# Altium schematic sheet DDS_refClk.SchDoc
size 594 x 420 mm; Address1: Address1; Address2: Address2; Address3: Address3; Address4: Address4; SheetNumber: 1; Scale: 1:1; Разраб.: Иванов; Обозначение документа: АБВГ.123456.001 Э3; Пров.: Петров; Утв.: Сидоров; Наименование организации: ОАО "Концерн "МПО-Гидроприбор"; Перв. применение: АБВГ.123456.000; Наименование изделия 1: Плата; Наименование изделия 2: Схема электрическая; Наименование изделия 3: принципиальная; Нач. отд.: Нач. отд.; Фамилия нач. отд.: Сидоров
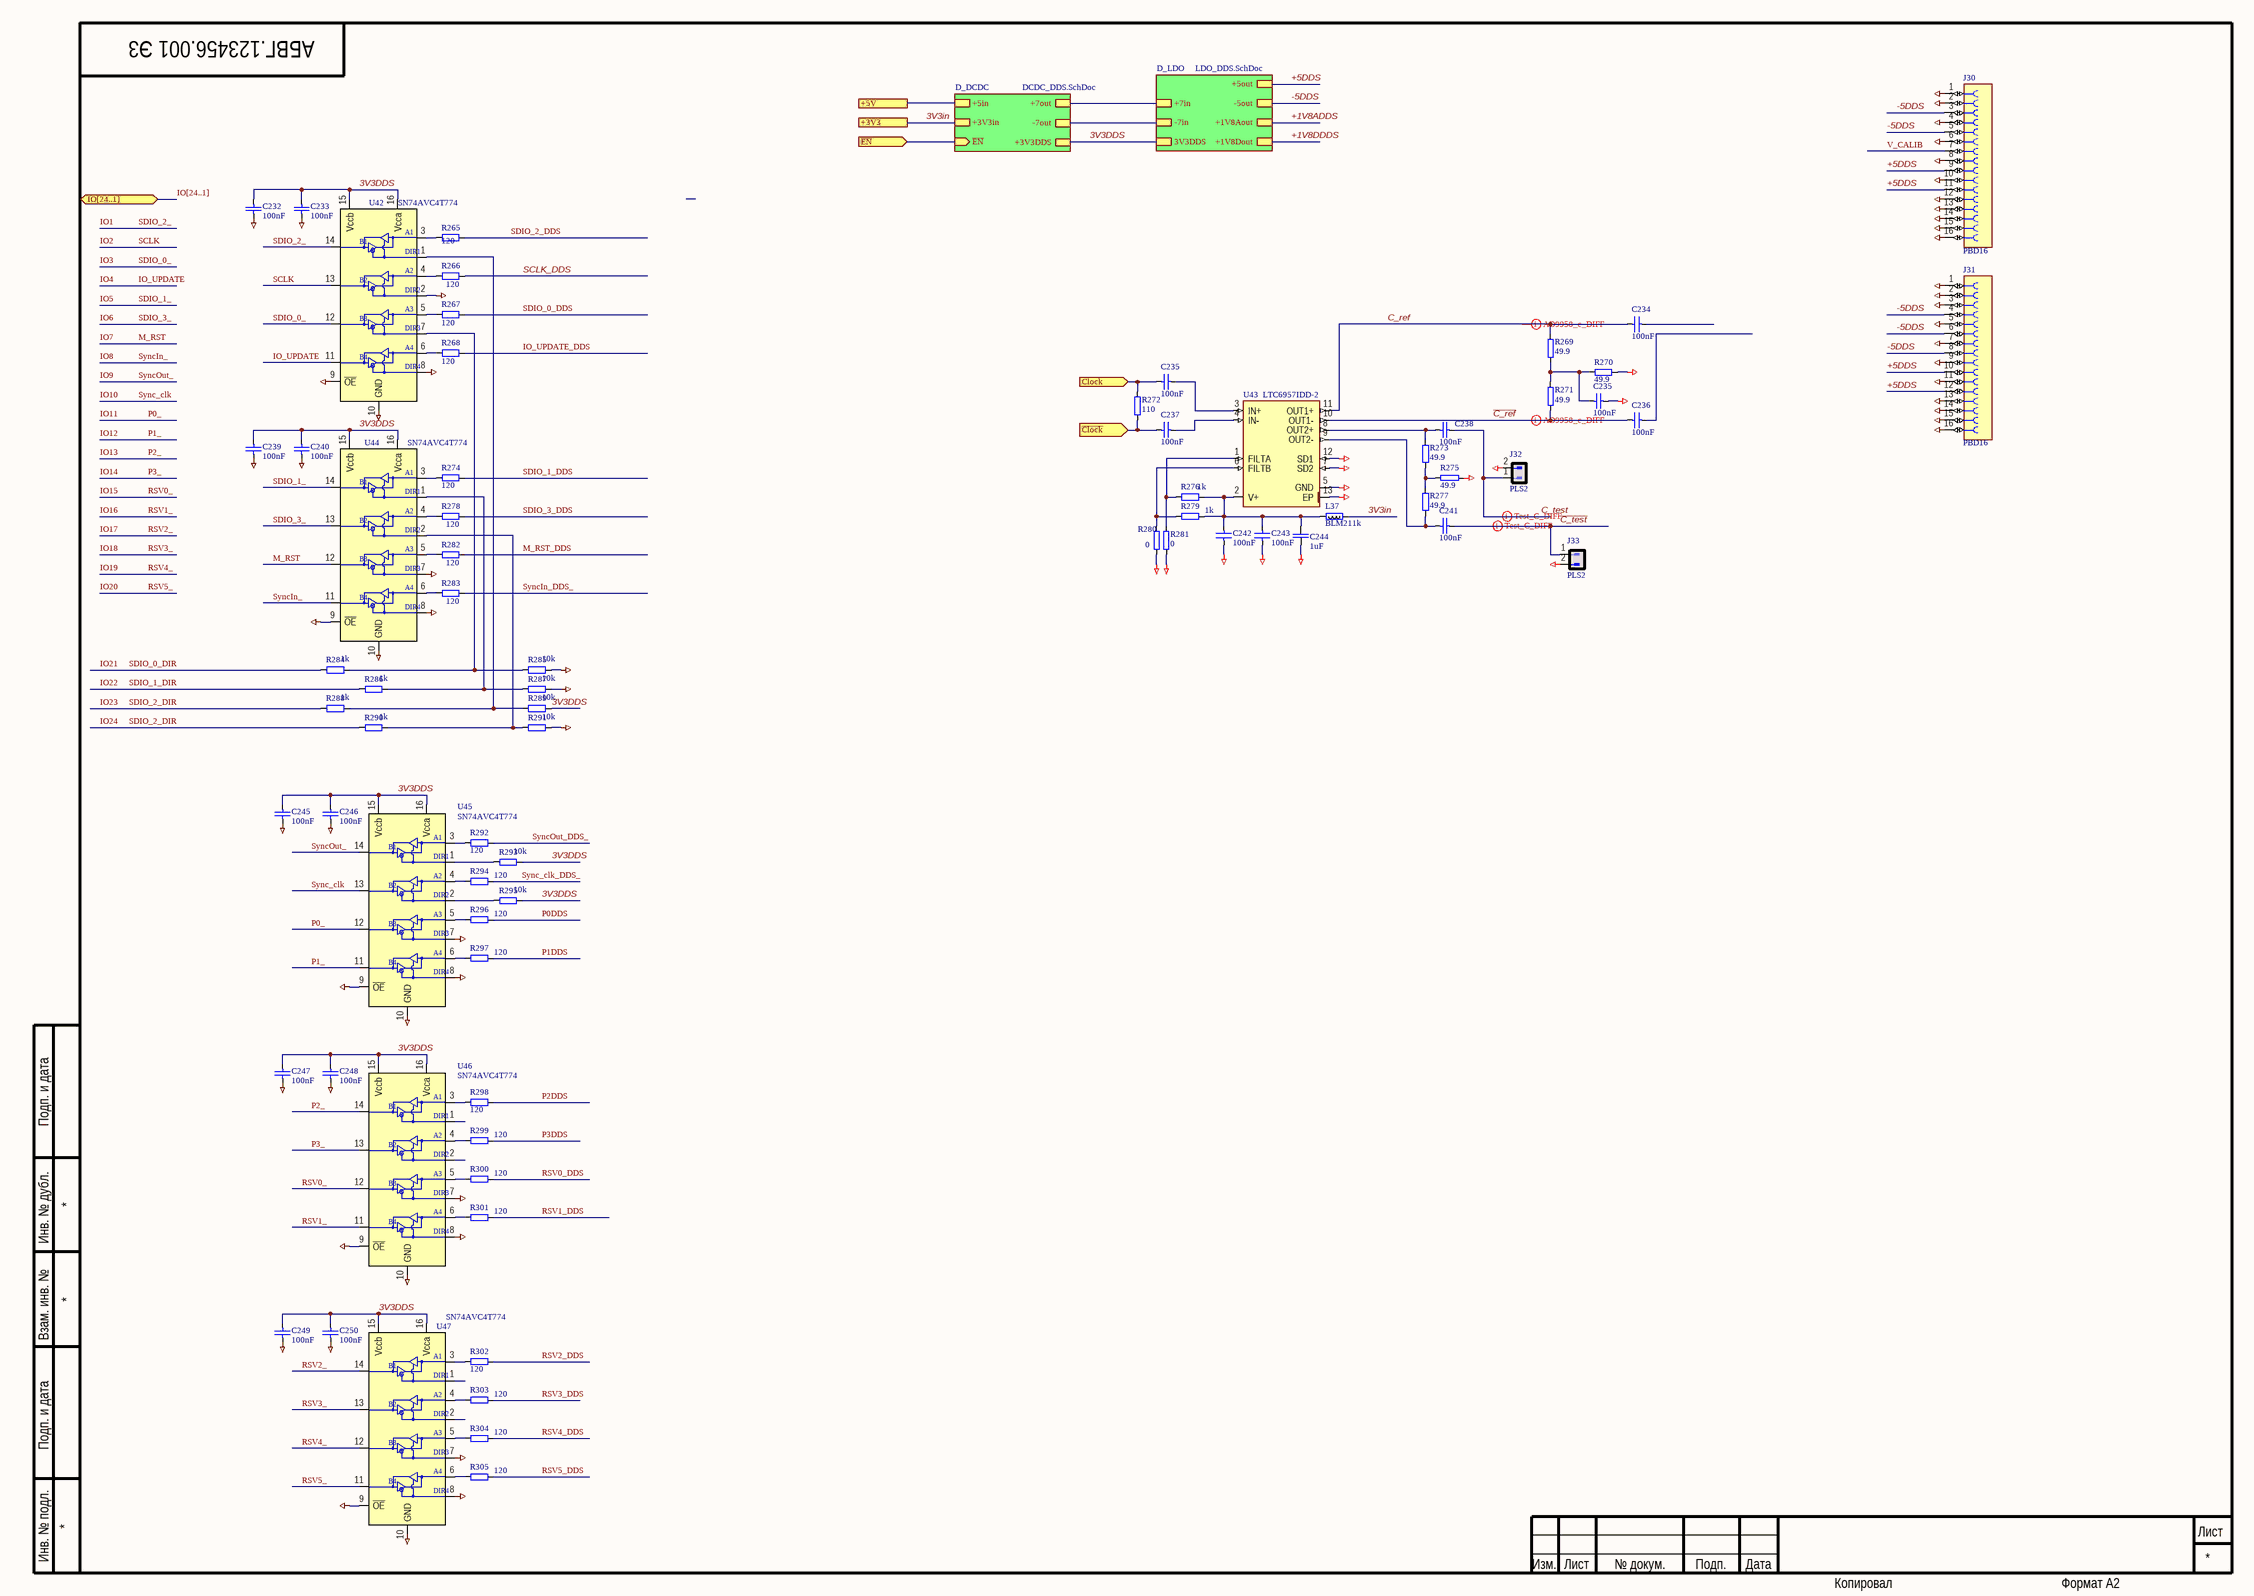
[diagram p0: DDS_refClk.SchDoc]

## Parts
(Parts that share a designator on the sheet are numbered #1, #2 ... from top to bottom, then left to right.)
C232  100nF  [SMD0805CAP]
C233  100nF  [SMD0805CAP]
C234  100nF  [SMD0805CAP]
C235#1  100nF  [SMD0805CAP]
C235#2  100nF  [SMD0805CAP]
C236  100nF  [SMD0805CAP]
C237  100nF  [SMD0805CAP]
C238  100nF  [SMD0805CAP]
C239  100nF  [SMD0805CAP]
C240  100nF  [SMD0805CAP]
C241  100nF  [SMD0805CAP]
C242  100nF  [SMD0805CAP]
C243  100nF  [SMD0805CAP]
C244  1uF  [0508]
C245  100nF  [SMD0805CAP]
C246  100nF  [SMD0805CAP]
C247  100nF  [SMD0805CAP]
C248  100nF  [SMD0805CAP]
C249  100nF  [SMD0805CAP]
C250  100nF  [SMD0805CAP]
J30  PBD16  [SAMTEC_SSW-108-02-G-D]
J31  PBD16  [SAMTEC_SSW-108-02-G-D]
J32  PLS2  [PLS2]
J33  PLS2  [PLS2]
L37  BLM211k  [RESC2012X50N]
R265  120  [SMD0805RES]
R266  120  [SMD0805RES]
R267  120  [SMD0805RES]
R268  120  [SMD0805RES]
R269  49.9  [SMD0805RES]
R270  49.9  [SMD0805RES]
R271  49.9  [SMD0805RES]
R272  110  [SMD0805RES]
R273  49.9  [SMD0805RES]
R274  120  [SMD0805RES]
R275  49.9  [SMD0805RES]
R276  1k  [SMD0805RES]
R277  49.9  [SMD0805RES]
R278  120  [SMD0805RES]
R279  1k  [SMD0805RES]
R280  0  [SMD0805RES]
R281  0  [SMD0805RES]
R282  120  [SMD0805RES]
R283  120  [SMD0805RES]
R284  1k  [SMD0805RES]
R285  10k  [SMD0805RES]
R286  1k  [SMD0805RES]
R287  10k  [SMD0805RES]
R288  1k  [SMD0805RES]
R289  10k  [SMD0805RES]
R290  1k  [SMD0805RES]
R291  10k  [SMD0805RES]
R292  120  [SMD0805RES]
R293  10k  [SMD0805RES]
R294  120  [SMD0805RES]
R295  10k  [SMD0805RES]
R296  120  [SMD0805RES]
R297  120  [SMD0805RES]
R298  120  [SMD0805RES]
R299  120  [SMD0805RES]
R300  120  [SMD0805RES]
R301  120  [SMD0805RES]
R302  120  [SMD0805RES]
R303  120  [SMD0805RES]
R304  120  [SMD0805RES]
R305  120  [SMD0805RES]
U42  SN74AVC4T774  [TSSOP-16]
U43  LTC6957IDD-2  [DFN13-045]
U44  SN74AVC4T774  [TSSOP-16]
U45  SN74AVC4T774  [TSSOP-16]
U46  SN74AVC4T774  [TSSOP-16]
U47  SN74AVC4T774  [TSSOP-16]

## Sub-sheets
D_DCDC = DCDC_DDS.SchDoc: +5in, +7out, -7out, +3V3DDS, +3V3in, ~{EN} (in)
D_LDO = LDO_DDS.SchDoc: +7in, -7in, -5out, +1V8Aout, +1V8Dout, +5out, 3V3DDS

## Ports
+3V3, +5V, Clock (in), IO[24..1] (bidir), ~{Clock} (in), ~{EN} (in)

## Nets
GND: C232.1 C233.1 C235#2.1 C239.1 C240.1 C242.2 C243.2 C244.2 C245.1 C246.1 C247.1 C248.1 C249.1 C250.1 J30.1 J30.2 J30.4 J30.6 J30.8 J30.10 J30.12 J30.13 J30.14 J30.15 J30.16 J31.1 J31.2 J31.3 J31.5 J31.7 J31.9 J31.11 J31.13 J31.14 J31.15 J31.16 J32.2 J33.2 R270.1 R275.1 R280.1 R281.1 R285.1 R287.1 R291.1 U42.2(DIR2) U42.8(DIR4) U42.9(~{OE}) U42.10(GND) U43.5(GND) U43.7(SD2) U43.12(SD1) U43.13(EP) U44.7(DIR3) U44.8(DIR4) U44.9(~{OE}) U44.10(GND) U45.7(DIR3) U45.8(DIR4) U45.9(~{OE}) U45.10(GND) U46.7(DIR3) U46.8(DIR4) U46.9(~{OE}) U46.10(GND) U47.7(DIR3) U47.8(DIR4) U47.9(~{OE}) U47.10(GND)
3V3DDS: C232.2 C233.2 C239.2 C240.2 C245.2 C246.2 C247.2 C248.2 C249.2 C250.2 R289.1 R293.1 R295.1 U42.15(Vccb) U42.16(Vcca) U44.15(Vccb) U44.16(Vcca) U45.15(Vccb) U45.16(Vcca) U46.15(Vccb) U46.16(Vcca) U47.15(Vccb) U47.16(Vcca) ; sheet D_LDO/3V3DDS
3V3in: L37.2 ; port +3V3, sheet D_DCDC/+3V3in
+1V8ADDS: sheet D_LDO/+1V8Aout
+1V8DDDS: sheet D_LDO/+1V8Dout
+5DDS: J30.9 J30.11 J31.10 J31.12 ; sheet D_LDO/+5out
+5V: port +5V, sheet D_DCDC/+5in
-5DDS: J30.3 J30.5 J31.4 J31.6 J31.8 ; sheet D_LDO/-5out
~{C_ref}: C236.2 R271.1 U43.10(OUT1-)
~{C_test}: C241.1 J33.1
~{Clock}: C237.2 R272.2 ; port ~{Clock}
~{EN}: port ~{EN}, sheet D_DCDC/~{EN}
C_ref: C234.2 R269.1 U43.11(OUT1+)
C_test: C238.1 J32.1
Clock: C235#1.2 R272.1 ; port Clock
IO1: U42.14(B1)  [also labelled SDIO_2_]
IO2: U42.13(B2)  [also labelled SCLK]
IO3: U42.12(B3)  [also labelled SDIO_0_]
IO4: U42.11(B4)  [also labelled IO_UPDATE]
IO5: U44.14(B1)  [also labelled SDIO_1_]
IO6: U44.13(B2)  [also labelled SDIO_3_]
IO7: U44.12(B3)  [also labelled M_RST]
IO8: U44.11(B4)  [also labelled SyncIn_]
IO9: U45.14(B1)  [also labelled SyncOut_]
IO10: U45.13(B2)  [also labelled Sync_clk]
IO11: U45.12(B3)  [also labelled P0_]
IO12: U45.11(B4)  [also labelled P1_]
IO13: U46.14(B1)  [also labelled P2_]
IO14: U46.13(B2)  [also labelled P3_]
IO15: U46.12(B3)  [also labelled RSV0_]
IO16: U46.11(B4)  [also labelled RSV1_]
IO17: U47.14(B1)  [also labelled RSV2_]
IO18: U47.13(B2)  [also labelled RSV3_]
IO19: U47.12(B3)  [also labelled RSV4_]
IO20: U47.11(B4)  [also labelled RSV5_]
IO21: R284.2  [also labelled SDIO_0_DIR]
IO22: R286.2  [also labelled SDIO_1_DIR]
IO23: R288.2 R290.2  [also labelled IO24, SDIO_2_DIR]
IO_UPDATE_DDS: R268.1
M_RST_DDS: R282.1
P0DDS: R296.1
P1DDS: R297.1
P2DDS: R298.1
P3DDS: R299.1
RSV0_DDS: R300.1
RSV1_DDS: R301.1
RSV2_DDS: R302.1
RSV3_DDS: R303.1
RSV4_DDS: R304.1
RSV5_DDS: R305.1
SCLK_DDS: R266.1
SDIO_0_DDS: R267.1
SDIO_1_DDS: R274.1
SDIO_2_DDS: R265.1
SDIO_3_DDS: R278.1
Sync_clk_DDS_: R294.1
SyncIn_DDS_: R283.1
SyncOut_DDS_: R292.1
V_CALIB: J30.7
NetC235#1_1: C235#1.1 U43.3(IN+)
NetC235#2_2: C235#2.2 R269.2 R270.2 R271.2
NetC237_1: C237.1 U43.4(IN-)
NetC238_2: C238.2 R273.1 U43.8(OUT2+)
NetC241_2: C241.2 R277.1 U43.9(OUT2-)
NetC242_1: C242.1 C243.1 C244.1 L37.1 R276.2 R279.2 U43.2(V+)
NetR265_2: R265.2 U42.3(A1)
NetR266_2: R266.2 U42.4(A2)
NetR267_2: R267.2 U42.5(A3)
NetR268_2: R268.2 U42.6(A4)
NetR273_2: R273.2 R275.2 R277.2
NetR274_2: R274.2 U44.3(A1)
NetR276_1: R276.1 R281.2 U43.1(FILTA)
NetR278_2: R278.2 U44.4(A2)
NetR279_1: R279.1 R280.2 U43.6(FILTB)
NetR282_2: R282.2 U44.5(A3)
NetR283_2: R283.2 U44.6(A4)
NetR284_1: R284.1 R285.2 U42.7(DIR3)
NetR286_1: R286.1 R287.2 U44.1(DIR1)
NetR288_1: R288.1 R289.2 U42.1(DIR1)
NetR290_1: R290.1 R291.2 U44.2(DIR2)
NetR292_2: R292.2 U45.3(A1)
NetR293_2: R293.2 U45.1(DIR1)
NetR294_2: R294.2 U45.4(A2)
NetR295_2: R295.2 U45.2(DIR2)
NetR296_2: R296.2 U45.5(A3)
NetR297_2: R297.2 U45.6(A4)
NetR298_2: R298.2 U46.3(A1)
NetR299_2: R299.2 U46.4(A2)
NetR300_2: R300.2 U46.5(A3)
NetR301_2: R301.2 U46.6(A4)
NetR302_2: R302.2 U47.3(A1)
NetR303_2: R303.2 U47.4(A2)
NetR304_2: R304.2 U47.5(A3)
NetR305_2: R305.2 U47.6(A4)
(unnamed): sheet D_DCDC/+7out, sheet D_LDO/+7in

Not connected (* = marked no-connect by the designer): C234 1; C236 1; U46 1(DIR1) 2(DIR2); U47 1(DIR1) 2(DIR2)

## Buses and harness runs
bus IO[24..1] = port IO[24..1]

## Layout directives
differential pair: C_ref, C_test, ~{C_ref}, ~{C_test}

## Notes on the sheet
- Подп. и дата
- Инв. № дубл.
- Взам. инв. №
- Инв. № подл.
- Изм.
- Лист
- № докум.
- Подп.
- Дата
- Копировал
- Формат А2

## Library data of the parts
C232-C234 C235#1 C235#2 C236-C243 C245-C250 = C0805: Чип конденсатор 0805; Voltage: 25V; Vendor: Vishay; DielectricType: X5R; SMD Solders: 2; Solder Option: RM; Tolerance: 20%; Pkg: SMD0805; Device: Cap0805; Value: 100nF; Price: 2
C244 = CAP_LLL219R71A105: 1uF; 10V; 0805R; X7R; Low ESL; Reverse geometry; Vendor: muRata; SolderOption: 2; THD Solders: 0; PartField: LLL219R71A105; Pkg: 0508; Value: 1uF; SMD Solders: 2; ClassName: Soldered_BINP
J30 J31 = PBD16: Розетка 2 ряда PBD 16/2.54; Vendor: Confly; SMD Solders: 0; Solder Option: RM; THD Solders: 16; Price: 20; Device: PBD16
J32 J33 = PLS2: Vendor: Confly; SMD Solders: 0; Solder Option: RM; THD Solders: 2; Price: 1; Device: PLS2
L37 = BLM21: SMD Ferrite bead 0805; Vendor: Vishay; Value: 1k; Pkg: SMD0805; SMD Solders: 2; Solder Option: RM; Price: 10; Device: BLM21
R265-R268 R272 R274 R278 R282-R305 = R0805: Чип резистор 0805; Vendor: Vishay; SMD Solders: 2; Solder Option: i; TC: 100ppm/C; Tolerance: 1%; Pkg: SMD0805; Pwr: 125mW; Device: Res0805; Price: 2
  R265-R268 R274 R278 R282 R283 R292 R294 R296-R305: Value: 120
  R272: Value: 110
  R284 R286 R288 R290: Value: 1k
  R285 R287 R289 R291 R293 R295: Value: 10k
R269-R271 R273 R275-R277 R279-R281 = R0805: Чип резистор 0805; Vendor: Vishay; SMD Solders: 2; Solder Option: RM; TC: 100ppm/C; Tolerance: 1%; Pkg: SMD0805; Pwr: 125mW; Device: Res0805; Price: 2
  R269-R271 R273 R275 R277: Value: 49.9
  R276 R279: Value: 1k
  R280 R281: Value: 0
U42 U44-U47 = SN74AVC4T774: Двунаправленный буфер; Pkg: TSSOP16; SMD Solders: 16; Solder Option: RM; THD Solders: 0; Vendor: Texas Instruments; Voltage: 1V1.. 3.6V  I/Os are 4.6-V Tolerant; Name to order: SN74AVC4T774PW; Device: SN74AVC4T774; Price: 300
U43 = LTC6957-2: Bufer CMOS in to 2xLVDS out; Vendor: Analog Devices; Pkg: DFN045-13; SMD Solders: 13; Solder Option: outSrc; THD Solders: 0; Current: 72; Voltage: 2.15.. 3.45; Price: 4200; Device: LTC6957IDD-2; Name to order: LTC6957IDD-2